# Altium project NA61_BPD_FEE.PrjPcb (part 1 of 4)
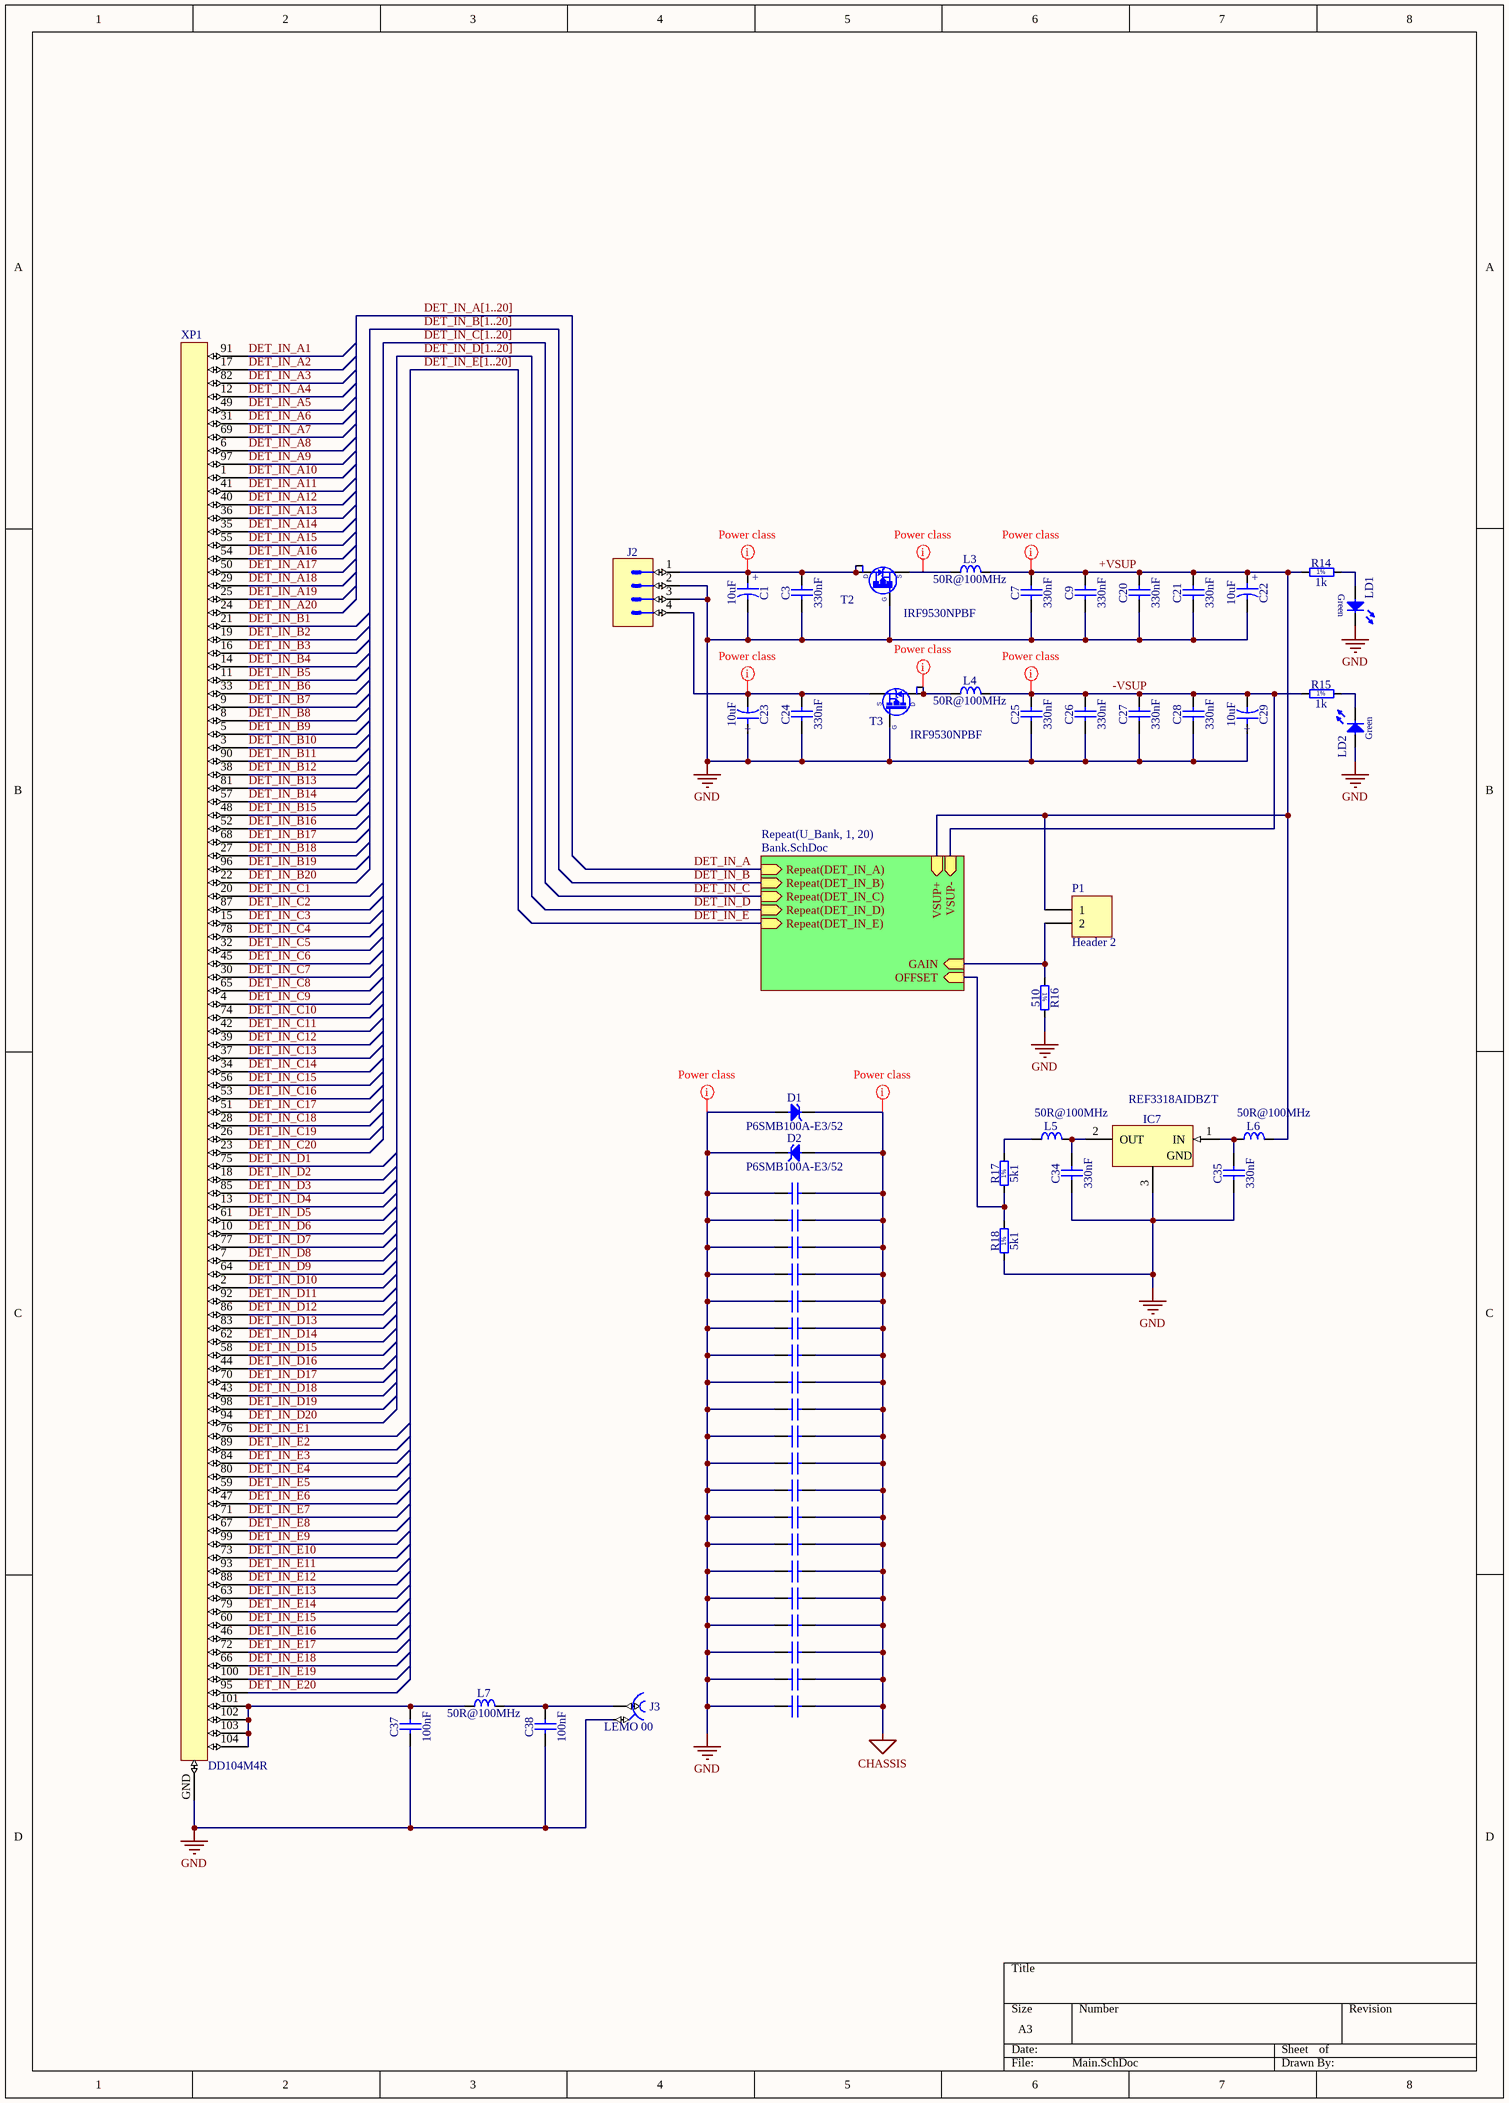
[diagram p0: Main.SchDoc]
3 sheets, 3559 parts. Net scope: hierarchical (ports join the sheet entries above them; power ports are global).
Board file: FEE_PCB.PcbDoc
Sheets:
  Main.SchDoc
    U_Bank1 = Bank.SchDoc
      U_Amp = Amp.SchDoc
      U_Amp = Amp.SchDoc
      U_Amp = Amp.SchDoc
      U_Amp = Amp.SchDoc
      U_Amp = Amp.SchDoc
    U_Bank2 = Bank.SchDoc
      U_Amp = Amp.SchDoc
      U_Amp = Amp.SchDoc
      U_Amp = Amp.SchDoc
      U_Amp = Amp.SchDoc
      U_Amp = Amp.SchDoc
    U_Bank3 = Bank.SchDoc
      U_Amp = Amp.SchDoc
      U_Amp = Amp.SchDoc
      U_Amp = Amp.SchDoc
      U_Amp = Amp.SchDoc
      U_Amp = Amp.SchDoc
    U_Bank4 = Bank.SchDoc
      U_Amp = Amp.SchDoc
      U_Amp = Amp.SchDoc
      U_Amp = Amp.SchDoc
      U_Amp = Amp.SchDoc
      U_Amp = Amp.SchDoc
    U_Bank5 = Bank.SchDoc
      U_Amp = Amp.SchDoc
      U_Amp = Amp.SchDoc
      U_Amp = Amp.SchDoc
      U_Amp = Amp.SchDoc
      U_Amp = Amp.SchDoc
    U_Bank6 = Bank.SchDoc
      U_Amp = Amp.SchDoc
      U_Amp = Amp.SchDoc
      U_Amp = Amp.SchDoc
      U_Amp = Amp.SchDoc
      U_Amp = Amp.SchDoc
    U_Bank7 = Bank.SchDoc
      U_Amp = Amp.SchDoc
      U_Amp = Amp.SchDoc
      U_Amp = Amp.SchDoc
      U_Amp = Amp.SchDoc
      U_Amp = Amp.SchDoc
    U_Bank8 = Bank.SchDoc
      U_Amp = Amp.SchDoc
      U_Amp = Amp.SchDoc
      U_Amp = Amp.SchDoc
      U_Amp = Amp.SchDoc
      U_Amp = Amp.SchDoc
    U_Bank9 = Bank.SchDoc
      U_Amp = Amp.SchDoc
      U_Amp = Amp.SchDoc
      U_Amp = Amp.SchDoc
      U_Amp = Amp.SchDoc
      U_Amp = Amp.SchDoc
    U_Bank10 = Bank.SchDoc
      U_Amp = Amp.SchDoc
      U_Amp = Amp.SchDoc
      U_Amp = Amp.SchDoc
      U_Amp = Amp.SchDoc
      U_Amp = Amp.SchDoc
    U_Bank11 = Bank.SchDoc
      U_Amp = Amp.SchDoc
      U_Amp = Amp.SchDoc
      U_Amp = Amp.SchDoc
      U_Amp = Amp.SchDoc
      U_Amp = Amp.SchDoc
    U_Bank12 = Bank.SchDoc
      U_Amp = Amp.SchDoc
      U_Amp = Amp.SchDoc
      U_Amp = Amp.SchDoc
      U_Amp = Amp.SchDoc
      U_Amp = Amp.SchDoc
    U_Bank13 = Bank.SchDoc
      U_Amp = Amp.SchDoc
      U_Amp = Amp.SchDoc
      U_Amp = Amp.SchDoc
      U_Amp = Amp.SchDoc
      U_Amp = Amp.SchDoc
    U_Bank14 = Bank.SchDoc
      U_Amp = Amp.SchDoc
      U_Amp = Amp.SchDoc
      U_Amp = Amp.SchDoc
      U_Amp = Amp.SchDoc
      U_Amp = Amp.SchDoc
    U_Bank15 = Bank.SchDoc
      U_Amp = Amp.SchDoc
      U_Amp = Amp.SchDoc
      U_Amp = Amp.SchDoc
      U_Amp = Amp.SchDoc
      U_Amp = Amp.SchDoc
    U_Bank16 = Bank.SchDoc
      U_Amp = Amp.SchDoc
      U_Amp = Amp.SchDoc
      U_Amp = Amp.SchDoc
      U_Amp = Amp.SchDoc
      U_Amp = Amp.SchDoc
    U_Bank17 = Bank.SchDoc
      U_Amp = Amp.SchDoc
      U_Amp = Amp.SchDoc
      U_Amp = Amp.SchDoc
      U_Amp = Amp.SchDoc
      U_Amp = Amp.SchDoc
    U_Bank18 = Bank.SchDoc
      U_Amp = Amp.SchDoc
      U_Amp = Amp.SchDoc
      U_Amp = Amp.SchDoc
      U_Amp = Amp.SchDoc
      U_Amp = Amp.SchDoc
    U_Bank19 = Bank.SchDoc
      U_Amp = Amp.SchDoc
      U_Amp = Amp.SchDoc
      U_Amp = Amp.SchDoc
      U_Amp = Amp.SchDoc
      U_Amp = Amp.SchDoc
    U_Bank20 = Bank.SchDoc
      U_Amp = Amp.SchDoc
      U_Amp = Amp.SchDoc
      U_Amp = Amp.SchDoc
      U_Amp = Amp.SchDoc
      U_Amp = Amp.SchDoc

## Sheet Main.SchDoc
size A3 portrait

### Parts
C1  10uF  [CAPAE430X540N]
C3  330nF  [CAPC2012X145N]
C7  330nF  [CAPC2012X145N]
C9  330nF  [CAPC2012X145N]
C20  330nF  [CAPC2012X145N]
C21  330nF  [CAPC2012X145N]
C22  10uF  [CAPAE430X540N]
C23  10uF  [CAPAE430X540N]
C24  330nF  [CAPC2012X145N]
C25  330nF  [CAPC2012X145N]
C26  330nF  [CAPC2012X145N]
C27  330nF  [CAPC2012X145N]
C28  330nF  [CAPC2012X145N]
C29  10uF  [CAPAE430X540N]
C31  100nF  [CAPC3216X140N]  (value not drawn)
C32  100nF  [CAPC3216X140N]  (value not drawn)
C33  100nF  [CAPC3216X140N]  (value not drawn)
C34  330nF  [CAPC2012X145N]
C35  330nF  [CAPC2012X145N]
C36  100nF  [CAPC3216X140N]  (value not drawn)
C37  100nF  [CAPC3216X140N]
C38  100nF  [CAPC3216X140N]
C39  100nF  [CAPC3216X140N]  (value not drawn)
C40  100nF  [CAPC3216X140N]  (value not drawn)
C41  100nF  [CAPC3216X140N]  (value not drawn)
C42  100nF  [CAPC3216X140N]  (value not drawn)
C43  100nF  [CAPC3216X140N]  (value not drawn)
C44  100nF  [CAPC3216X140N]  (value not drawn)
C45  100nF  [CAPC3216X140N]  (value not drawn)
C46  100nF  [CAPC3216X140N]  (value not drawn)
C47  100nF  [CAPC3216X140N]  (value not drawn)
C48  100nF  [CAPC3216X140N]  (value not drawn)
C49  100nF  [CAPC3216X140N]  (value not drawn)
C50  100nF  [CAPC3216X140N]  (value not drawn)
C51  100nF  [CAPC3216X140N]  (value not drawn)
C52  100nF  [CAPC3216X140N]  (value not drawn)
C53  100nF  [CAPC3216X140N]  (value not drawn)
C54  100nF  [CAPC3216X140N]  (value not drawn)
D1  P6SMB100A-E3/52  [DIOM5436X244N]
D2  P6SMB100A-E3/52  [DIOM5436X244N]
IC7  REF3318AIDBZT  [SOT95P237X112-3N]
J2  Header 4  [WURTH_691 313 410 004]  (value not drawn)
J3  LEMO 00  [LEMO_EPK.00.250.NTN]
L3  50R@100MHz  [IND_MURATA_BLM31PG]
L4  50R@100MHz  [IND_MURATA_BLM31PG]
L5  50R@100MHz  [IND_MURATA_BLM31PG]
L6  50R@100MHz  [IND_MURATA_BLM31PG]
L7  50R@100MHz  [IND_MURATA_BLM31PG]
LD1  Green  [LED_OSRAM_LGR971]  (value not drawn)
LD2  Green  [LED_OSRAM_LGR971]  (value not drawn)
P1  Header 2  [HDR1X2]
R14  1k  [RESC2012X60N]
R15  1k  [RESC2012X60N]
R16  510  [RESC2012X60N]
R17  5k1  [RESC2012X60N]
R18  5k1  [RESC2012X60N]
T2  IRF9530NPBF  [TO-220-H]
T3  IRF9530NPBF  [TO-220-H]
XP1  DD104M4R  [DB104]

### Sub-sheets
Repeat(U_Bank, 1, 20) = Bank.SchDoc: VSUP+ (in), VSUP- (in), GAIN (in), OFFSET (in), Repeat(DET_IN_E) (in), Repeat(DET_IN_D) (in), Repeat(DET_IN_C) (in), Repeat(DET_IN_B) (in), Repeat(DET_IN_A) (in)

### Nets
CHASSIS: C31.2 C32.2 C33.2 C36.2 C39.2 C40.2 C41.2 C42.2 C43.2 C44.2 C45.2 C46.2 C47.2 C48.2 C49.2 C50.2 C51.2 C52.2 C53.2 C54.2 D1.1(C) D2.2(A)
GND: C1.2 C3.1 C7.1 C9.1 C20.1 C21.1 C22.2 C23.1 C24.1 C25.1 C26.1 C27.1 C28.1 C29.1 C31.1 C32.1 C33.1 C34.1 C35.1 C36.1 C37.1 C38.1 C39.1 C40.1 C41.1 C42.1 C43.1 C44.1 C45.1 C46.1 C47.1 C48.1 C49.1 C50.1 C51.1 C52.1 C53.1 C54.1 D1.2(A) D2.1(C) IC7.3(GND) J2.2 J2.3 J3.2 LD1.1(C) LD2.2(A) R16.2 R18.1 T2.1(G) T3.1(G) XP1.GND
+VSUP: C7.2 C9.2 C20.2 C21.2 C22.1 L3.2 L6.2 P1.1 R14.1 ; sheet Repeat(U_Bank, 1, 20)/VSUP+
-VSUP: C25.2 C26.2 C27.2 C28.2 C29.2 L4.2 R15.1 ; sheet Repeat(U_Bank, 1, 20)/VSUP-
DET_IN_A: sheet Repeat(U_Bank, 1, 20)/Repeat(DET_IN_A)
DET_IN_A1: XP1.91  [project net DET_IN_A]
DET_IN_A2: XP1.17  [project net DET_IN_A]
DET_IN_A3: XP1.82  [project net DET_IN_A]
DET_IN_A4: XP1.12  [project net DET_IN_A]
DET_IN_A5: XP1.49  [project net DET_IN_A]
DET_IN_A6: XP1.31  [project net DET_IN_A]
DET_IN_A7: XP1.69  [project net DET_IN_A]
DET_IN_A8: XP1.6  [project net DET_IN_A]
DET_IN_A9: XP1.97  [project net DET_IN_A]
DET_IN_A10: XP1.1  [project net DET_IN_A]
DET_IN_A11: XP1.41  [project net DET_IN_A]
DET_IN_A12: XP1.40  [project net DET_IN_A]
DET_IN_A13: XP1.36  [project net DET_IN_A]
DET_IN_A14: XP1.35  [project net DET_IN_A]
DET_IN_A15: XP1.55  [project net DET_IN_A]
DET_IN_A16: XP1.54  [project net DET_IN_A]
DET_IN_A17: XP1.50  [project net DET_IN_A]
DET_IN_A18: XP1.29  [project net DET_IN_A]
DET_IN_A19: XP1.25  [project net DET_IN_A]
DET_IN_A20: XP1.24  [project net DET_IN_A]
DET_IN_B: sheet Repeat(U_Bank, 1, 20)/Repeat(DET_IN_B)
DET_IN_B1: XP1.21  [project net DET_IN_B]
DET_IN_B2: XP1.19  [project net DET_IN_B]
DET_IN_B3: XP1.16  [project net DET_IN_B]
DET_IN_B4: XP1.14  [project net DET_IN_B]
DET_IN_B5: XP1.11  [project net DET_IN_B]
DET_IN_B6: XP1.33  [project net DET_IN_B]
DET_IN_B7: XP1.9  [project net DET_IN_B]
DET_IN_B8: XP1.8  [project net DET_IN_B]
DET_IN_B9: XP1.5  [project net DET_IN_B]
DET_IN_B10: XP1.3  [project net DET_IN_B]
DET_IN_B11: XP1.90  [project net DET_IN_B]
DET_IN_B12: XP1.38  [project net DET_IN_B]
DET_IN_B13: XP1.81  [project net DET_IN_B]
DET_IN_B14: XP1.57  [project net DET_IN_B]
DET_IN_B15: XP1.48  [project net DET_IN_B]
DET_IN_B16: XP1.52  [project net DET_IN_B]
DET_IN_B17: XP1.68  [project net DET_IN_B]
DET_IN_B18: XP1.27  [project net DET_IN_B]
DET_IN_B19: XP1.96  [project net DET_IN_B]
DET_IN_B20: XP1.22  [project net DET_IN_B]
DET_IN_C: sheet Repeat(U_Bank, 1, 20)/Repeat(DET_IN_C)
DET_IN_C1: XP1.20  [project net DET_IN_C]
DET_IN_C2: XP1.87  [project net DET_IN_C]
DET_IN_C3: XP1.15  [project net DET_IN_C]
DET_IN_C4: XP1.78  [project net DET_IN_C]
DET_IN_C5: XP1.32  [project net DET_IN_C]
DET_IN_C6: XP1.45  [project net DET_IN_C]
DET_IN_C7: XP1.30  [project net DET_IN_C]
DET_IN_C8: XP1.65  [project net DET_IN_C]
DET_IN_C9: XP1.4  [project net DET_IN_C]
DET_IN_C10: XP1.74  [project net DET_IN_C]
DET_IN_C11: XP1.42  [project net DET_IN_C]
DET_IN_C12: XP1.39  [project net DET_IN_C]
DET_IN_C13: XP1.37  [project net DET_IN_C]
DET_IN_C14: XP1.34  [project net DET_IN_C]
DET_IN_C15: XP1.56  [project net DET_IN_C]
DET_IN_C16: XP1.53  [project net DET_IN_C]
DET_IN_C17: XP1.51  [project net DET_IN_C]
DET_IN_C18: XP1.28  [project net DET_IN_C]
DET_IN_C19: XP1.26  [project net DET_IN_C]
DET_IN_C20: XP1.23  [project net DET_IN_C]
DET_IN_D: sheet Repeat(U_Bank, 1, 20)/Repeat(DET_IN_D)
DET_IN_D1: XP1.75  [project net DET_IN_D]
DET_IN_D2: XP1.18  [project net DET_IN_D]
DET_IN_D3: XP1.85  [project net DET_IN_D]
DET_IN_D4: XP1.13  [project net DET_IN_D]
DET_IN_D5: XP1.61  [project net DET_IN_D]
DET_IN_D6: XP1.10  [project net DET_IN_D]
DET_IN_D7: XP1.77  [project net DET_IN_D]
DET_IN_D8: XP1.7  [project net DET_IN_D]
DET_IN_D9: XP1.64  [project net DET_IN_D]
DET_IN_D10: XP1.2  [project net DET_IN_D]
DET_IN_D11: XP1.92  [project net DET_IN_D]
DET_IN_D12: XP1.86  [project net DET_IN_D]
DET_IN_D13: XP1.83  [project net DET_IN_D]
DET_IN_D14: XP1.62  [project net DET_IN_D]
DET_IN_D15: XP1.58  [project net DET_IN_D]
DET_IN_D16: XP1.44  [project net DET_IN_D]
DET_IN_D17: XP1.70  [project net DET_IN_D]
DET_IN_D18: XP1.43  [project net DET_IN_D]
DET_IN_D19: XP1.98  [project net DET_IN_D]
DET_IN_D20: XP1.94  [project net DET_IN_D]
DET_IN_E: sheet Repeat(U_Bank, 1, 20)/Repeat(DET_IN_E)
DET_IN_E1: XP1.76  [project net DET_IN_E]
DET_IN_E2: XP1.89  [project net DET_IN_E]
DET_IN_E3: XP1.84  [project net DET_IN_E]
DET_IN_E4: XP1.80  [project net DET_IN_E]
DET_IN_E5: XP1.59  [project net DET_IN_E]
DET_IN_E6: XP1.47  [project net DET_IN_E]
DET_IN_E7: XP1.71  [project net DET_IN_E]
DET_IN_E8: XP1.67  [project net DET_IN_E]
DET_IN_E9: XP1.99  [project net DET_IN_E]
DET_IN_E10: XP1.73  [project net DET_IN_E]
DET_IN_E11: XP1.93  [project net DET_IN_E]
DET_IN_E12: XP1.88  [project net DET_IN_E]
DET_IN_E13: XP1.63  [project net DET_IN_E]
DET_IN_E14: XP1.79  [project net DET_IN_E]
DET_IN_E15: XP1.60  [project net DET_IN_E]
DET_IN_E16: XP1.46  [project net DET_IN_E]
DET_IN_E17: XP1.72  [project net DET_IN_E]
DET_IN_E18: XP1.66  [project net DET_IN_E]
DET_IN_E19: XP1.100  [project net DET_IN_E]
DET_IN_E20: XP1.95  [project net DET_IN_E]
NetC1_1: C1.1 C3.2 J2.1 T2.2(D) T2.4(D)
NetC23_2: C23.2 C24.2 J2.4 T3.3(S)
NetC34_2: C34.2 IC7.2(OUT) L5.2
NetC35_2: C35.2 IC7.1(IN) L6.1
NetC37_2: C37.2 L7.1 XP1.101 XP1.102 XP1.103 XP1.104
NetC38_2: C38.2 J3.1 L7.2
NetL3_1: L3.1 T2.3(S)
NetL4_1: L4.1 T3.2(D) T3.4(D)
NetL5_1: L5.1 R17.2
NetLD1_2: LD1.2(A) R14.2
NetLD2_1: LD2.1(C) R15.2
NetP1_2: P1.2 R16.1 ; sheet Repeat(U_Bank, 1, 20)/GAIN
NetR12_U_Bank1_1: R17.1 R18.2 ; sheet Repeat(U_Bank, 1, 20)/OFFSET

### Buses and harness runs
bus DET_IN_A[1..20]
bus DET_IN_B[1..20]
bus DET_IN_C[1..20]
bus DET_IN_D[1..20]
bus DET_IN_E[1..20]

### Layout directives
net class Power: +VSUP, -VSUP, CHASSIS, GND, NetC1_1, NetC23_2, NetL3_1, NetL4_1

### Notes on the sheet
- (in symbol CAE430-540_10UF_16V_20%) +
- (in symbol R0805_1K_1%_0.125W_100PPM) 1%
- (in symbol R0805_5K1_1%_0.125W_100PPM) 1%
- (in symbol R0805_510R_1%_0.125W_100PPM) 1%

### Library data of the parts
C1 C22 C23 C29 = CAE430-540_10UF_16V_20%: Polarised capacitor; Part Description: Aluminum Electrolytic SMT Capacitor; Manufacturer: PANASONIC; Manufacturer Part Number: EEEFK1C100AR; Voltage: 16V; Tolerance: ±20%; Part Number: CAE430-540_10UF_16V_20%; Component Kind: Standard; Component Type: Standard; Pin Count: 2; Value: 10uF; Status: Not Recommended; Case: B; Mounted: Yes; Socket: No; SMD: Yes; Sense: No; ComponentHeight: 5.8mm; HelpURL: \\cern.ch\dfs\Applications\Altium\Datasheets\CAE_PANASONIC_FK.pdf; Author: CERN DEM JLC; CreateDate: 03.12.2007; LatestRevisionDate: 05.11.2014
C3 C7 C9 C20 C21 C24-C28 C34 C35 = CC0805_330NF_50V_20%_X5R: Non-polarised capacitor; Part Description: SMD Multilayer Chip Ceramic Capacitor; Manufacturer: GENERIC; Manufacturer1 Part Number: C2012X5R1H334M125AA; Voltage: 50V; TC: X5R; Tolerance: ±20%; Part Number: CC0805_330NF_50V_20%_X5R; Component Kind: Standard; Component Type: Standard; Pin Count: 2; Value: 330nF; Status: Preferred; Manufacturer Part Number: CC0805_330NF_50V_20%_X5R; Case: 0805; Mounted: Yes; Socket: No; SMD: Yes; Sense: No; Manufacturer1 Example: TDK; Manufacturer1 ComponentHeight: 1.45mm; HelpURL: \\cern.ch\dfs\Applications\Altium\Datasheets\CC0805_X5R_TDK_C.pdf; Author: CERN DEM MR; CreateDate: 16.09.2016; LatestRevisionDate: 16.09.2016
C31-C33 C36-C54 = CC1206_100NF_200V_10%_X7R: Non-polarised capacitor; Part Description: SMD Ceramic Chip Capacitor; Manufacturer: GENERIC; Manufacturer1 Part Number: C1206C104K2RAC; Voltage: 200V; TC: X7R; Tolerance: ±10%; Part Number: CC1206_100NF_200V_10%_X7R; Component Kind: Standard; Component Type: Standard; Pin Count: 2; Value: 100nF; Status: None; Manufacturer Part Number: CC1206_100NF_200V_10%_X7R; Case: 1206; Mounted: Yes; Socket: No; SMD: Yes; Sense: No; Manufacturer1 Example: KEMET; Manufacturer1 ComponentHeight: 1.4mm; HelpURL: \\cern.ch\dfs\Applications\Altium\Datasheets\CC1206_X7R_KEMET.pdf; Author: CERN DEM JLC; CreateDate: 16.09.2009; LatestRevisionDate: 16.09.2009
D1 D2 = P6SMB100A-E3/52: Transient Voltage Suppressor Diode (Uni-Directional); Part Description: Surface Mount Uni-directional TRANSZORB® Transient Voltage Suppressor; Manufacturer: VISHAY GENERAL SEMICONDUCTOR; Voltage: 100V; Power: 600W; PressFit: No; Bonding: No; Part Number: P6SMB100A-E3/52; Component Kind: Standard; Component Type: Standard; Device: P6SMB100A-E3/52; PackageDescription: DO-214-AA/SMB Diode, Molded Body; 5.40mm L X 3.62mm W X 2.44mm H, IPC Medium Density; Manufacturer Part Number: P6SMB100A-E3/52; Pin Count: 2; Case: SMB; Mounted: Yes; Socket: No; SMD: Yes; Sense: No; ComponentHeight: 2.44mm; HelpURL: \\cern.ch\dfs\Applications\Altium\Datasheets\P6SMB100A-E3-52.pdf; Author: CERN DEM JLC; CreateDate: 15.11.2016; LatestRevisionDate: 12.07.2017
IC7 = REF3318AIDBZT: 3-Terminal Regulator 1=IN 2=OUT 3=GND; Part Description: 1.8V, 30ppm/°C Drift, 3.9uA, Voltage Reference; Manufacturer: TEXAS INSTRUMENTS; PressFit: No; Bonding: No; Part Number: REF3318AIDBZT; Component Kind: Standard; Component Type: Standard; Device: REF3318AIDBZT; PackageDescription: SOT, 0.95mm, pitch; 3 pin,1.30mm W X 2.92mm L X 1.12mm H body, IPC Medium Density; Manufacturer Part Number: REF3318AIDBZT; Pin Count: 3; Case: SOT23; Mounted: Yes; Socket: No; SMD: Yes; Sense: No; ComponentHeight: 1.12mm; HelpURL: \\cern.ch\dfs\Applications\Altium\Datasheets\REF3318AIDBZT.pdf; Author: CERN DEM JLC; CreateDate: 20.06.2011; LatestRevisionDate: 20.06.2011
J2 = WURTH_691 313 410 004: Connector 4 Male; Part Description: 4 Contacts, Single Row, Right Angled Serie 3134-7.62mm; Manufacturer: WURTH ELEKTRONIK; PressFit: No; Part Number: WURTH_691 313 410 004; Component Kind: Standard; Component Type: Standard; Pin Count: 4; Family: Header 4; Mounted: Yes; Socket: No; SMD: No; Sense: No; Status: None; Manufacturer Part Number: 691 313 410 004; ComponentHeight: 8.5mm; HelpURL: \\cern.ch\dfs\Applications\Altium\Datasheets\WURTH_691 313 410 004.pdf; Author: CERN DEM MR; CreateDate: 08.04.2016; LatestRevisionDate: 08.04.2016
J3 = LEMO_EPK.00.250.NTN: Part Description: Size 00, 50 Ohms Coaxial Elbow (90°) socket With Clearance Under The Body; PressFit: No; SCEM: 09.46.11.180.6; Part Number: LEMO_EPK.00.250.NTN; Component Kind: Standard; Component Type: Standard; Pin Count: 2; Family: LEMO 00; Mounted: Yes; Socket: No; SMD: No; Sense: No; Status: None; Manufacturer: LEMO; Manufacturer Part Number: EPK.00.250.NTN; ComponentHeight: 7mm; HelpURL: \\cern.ch\dfs\Applications\Altium\Datasheets\LEMO_EPK.00.250.NTN.pdf; Author: CERN DEM JLC; CreateDate: 04.09.2012; LatestRevisionDate: 04.09.2012
L3-L7 = IND1206_MURATA_BLM31PG500SN1: Inductor; Part Description: SMD EMIFIL Chip Ferrite Bead; Manufacturer: MURATA; Power: 3.5A; Resistance: 0.015R; Part Number: IND1206_MURATA_BLM31PG500SN1; Component Kind: Standard; Component Type: Standard; Pin Count: 2; Value: 50R@100MHz; Status: None; Manufacturer Part Number: BLM31PG500SN1; Case: 1206; Mounted: Yes; Socket: No; SMD: Yes; Sense: No; ComponentHeight: 1.3mm; HelpURL: \\cern.ch\dfs\Applications\Altium\Datasheets\IND1206_MURATA_BLM31P.pdf; Author: CERN DEM JLC; CreateDate: 05.12.2013; LatestRevisionDate: 05.12.2013
LD1 LD2 = LED_OSRAM_LGR971: LED Green 1C 2A; Part Description: Surface Mount Green LED (0805 Case); Manufacturer: OSRAM; Manufacturer Part Number: LGR971; PressFit: No; Bonding: No; Part Number: LED_OSRAM_LGR971; Component Kind: Standard; Component Type: Standard; Color: Green; PackageDescription: Green Chip LED, 2-Leads, Body 2.0x1.25mm, IPC Medium Density; Pin Count: 2; Case: 0805; Mounted: Yes; Socket: No; SMD: Yes; Sense: No; ComponentHeight: 0.9mm; HelpURL: \\cern.ch\dfs\Applications\Altium\Datasheets\LED_OSRAM_LGR971.pdf; Author: CERN DEM JLC; CreateDate: 28.01.2009; LatestRevisionDate: 17.03.2010
P1 = Header 2: Header, 2-Pin; LatestRevisionDate: 17-Jul-2002; LatestRevisionNote: Re-released for DXP Platform.; Publisher: Altium Limited
R14 R15 = R0805_1K_1%_0.125W_100PPM: Resistor - 1%; Part Description: General Purpose Thick Film Chip Resistor; Manufacturer: GENERIC; Manufacturer1 Part Number: NRC10F1001TRF; Power: 0.125W; TC: ±100ppm/°C; PressFit: No; Part Number: R0805_1K_1%_0.125W_100PPM; Component Kind: Standard; Component Type: Standard; Pin Count: 2; Value: 1k; Status: Preferred; Tolerance: ±1%; Manufacturer Part Number: R0805_1K_1%_0.125W_100PPM; Case: 0805; Mounted: Yes; Sense: No; Socket: No; SMD: Yes; Manufacturer1 Example: NIC COMPONENT; Manufacturer1 ComponentHeight: 0.6mm; HelpURL: \\cern.ch\dfs\Applications\Altium\Datasheets\R0805_NIC_NRC.pdf; Author: CERN DEM JLC; CreateDate: 03.12.2007; LatestRevisionDate: 13.03.2008
R16 = R0805_510R_1%_0.125W_100PPM: Resistor - 1%; Part Description: General Purpose Thick Film Chip Resistor; Manufacturer: GENERIC; Manufacturer1 Part Number: NRC10F5100TRF; Power: 0.125W; TC: ±100ppm/°C; PressFit: No; Part Number: R0805_510R_1%_0.125W_100PPM; Component Kind: Standard; Component Type: Standard; Pin Count: 2; Value: 510; Status: Preferred; Tolerance: ±1%; Manufacturer Part Number: R0805_510R_1%_0.125W_100PPM; Case: 0805; Mounted: Yes; Sense: No; Socket: No; SMD: Yes; Manufacturer1 Example: NIC COMPONENT; Manufacturer1 ComponentHeight: 0.6mm; HelpURL: \\cern.ch\dfs\Applications\Altium\Datasheets\R0805_NIC_NRC.pdf; Author: CERN DEM JLC; CreateDate: 03.12.2007; LatestRevisionDate: 13.03.2008
R17 R18 = R0805_5K1_1%_0.125W_100PPM: Resistor - 1%; Part Description: General Purpose Thick Film Chip Resistor; Manufacturer: GENERIC; Manufacturer1 Part Number: NRC10F5101TRF; Power: 0.125W; TC: ±100ppm/°C; PressFit: No; Part Number: R0805_5K1_1%_0.125W_100PPM; Component Kind: Standard; Component Type: Standard; Pin Count: 2; Value: 5k1; Status: Preferred; Tolerance: ±1%; Manufacturer Part Number: R0805_5K1_1%_0.125W_100PPM; Case: 0805; Mounted: Yes; Sense: No; Socket: No; SMD: Yes; Manufacturer1 Example: NIC COMPONENT; Manufacturer1 ComponentHeight: 0.6mm; HelpURL: \\cern.ch\dfs\Applications\Altium\Datasheets\R0805_NIC_NRC.pdf; Author: CERN DEM JLC; CreateDate: 03.12.2007; LatestRevisionDate: 13.03.2008
T2 T3 = IRF9530NPBF_h: P-CHANNEL MOSFET WITH ZENER DIODE; Part Description: -100V -14A P-Channel HEXFET Power MOSFET; Manufacturer: INTERNATIONAL RECTIFIER; PressFit: No; Bonding: No; Part Number: IRF9530NPBF_h; Component Kind: Standard; Component Type: Standard; Device: IRF9530NPBF; PackageDescription: TO-220 3-Terminal + Tab - Horizontal; Manufacturer Part Number: IRF9530NPBF; Pin Count: 4; Case: TO-220; Mounted: Yes; Socket: No; SMD: No; Sense: No; ComponentHeight: 4.69mm; HelpURL: \\cern.ch\dfs\Applications\Altium\Datasheets\IRF9530NPBF.pdf; Author: CERN DEM MR; CreateDate: 21.10.2016; LatestRevisionDate: 21.10.2016

## Sheet Bank.SchDoc
size A4
Used 20 times, as channels U_Bank1, U_Bank2, U_Bank3, U_Bank4, U_Bank5, U_Bank6, U_Bank7, U_Bank8, U_Bank9, U_Bank10, U_Bank11, U_Bank12, U_Bank13, U_Bank14, U_Bank15, U_Bank16, U_Bank17, U_Bank18, U_Bank19, U_Bank20. Parts and nets are listed once, with the designators drawn on the sheet.
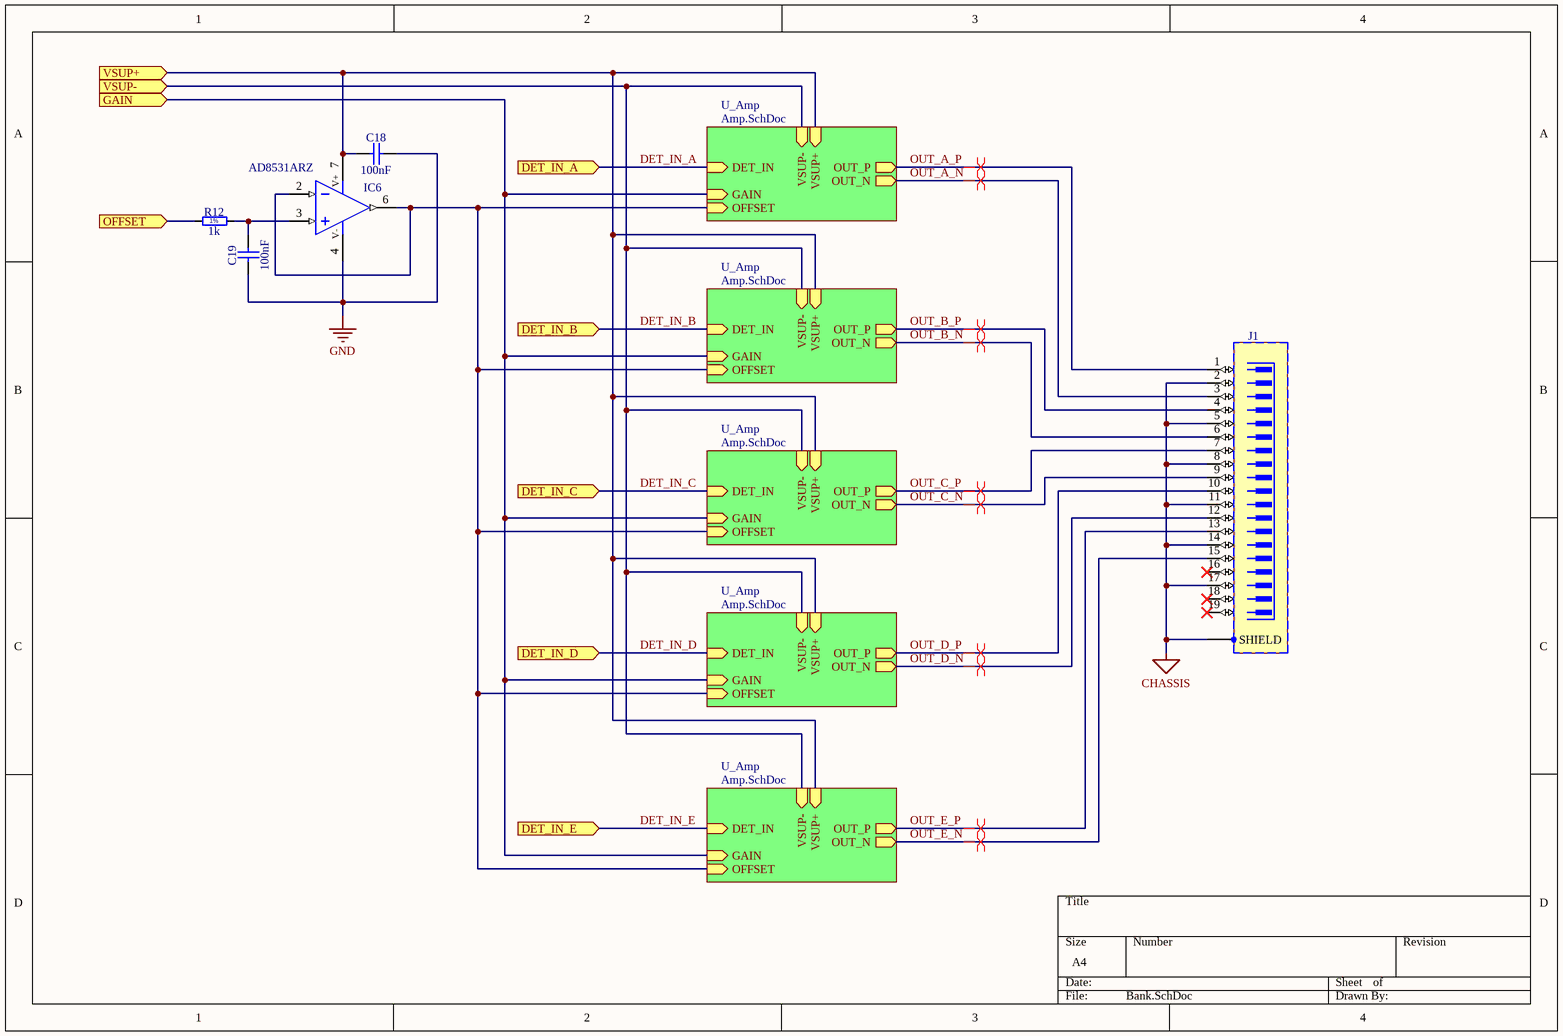
[diagram p1: Bank.SchDoc]

### Parts
C18  100nF  [CAPC2012X135N]
C19  100nF  [CAPC2012X135N]
IC6  AD8531ARZ  [SOIC127P600X175-8N]
J1  HDMI  [TYCO_2007435-1]  (value not drawn)
R12  1k  [RESC2012X60N]

### Sub-sheets
U_Amp = Amp.SchDoc: VSUP+ (in), VSUP- (in), DET_IN (in), OFFSET (in), OUT_P (out), OUT_N (out), GAIN (in)
U_Amp = Amp.SchDoc: VSUP+ (in), VSUP- (in), DET_IN (in), OFFSET (in), OUT_P (out), OUT_N (out), GAIN (in)
U_Amp = Amp.SchDoc: VSUP+ (in), VSUP- (in), DET_IN (in), OFFSET (in), OUT_P (out), OUT_N (out), GAIN (in)
U_Amp = Amp.SchDoc: VSUP+ (in), VSUP- (in), DET_IN (in), OFFSET (in), OUT_P (out), OUT_N (out), GAIN (in)
U_Amp = Amp.SchDoc: VSUP+ (in), VSUP- (in), DET_IN (in), OFFSET (in), OUT_P (out), OUT_N (out), GAIN (in)

### Ports
DET_IN_A (in), DET_IN_B (in), DET_IN_C (in), DET_IN_D (in), DET_IN_E (in), GAIN (in), OFFSET (in), VSUP+ (in), VSUP- (in)

### Nets
CHASSIS: J1.2 J1.5 J1.8 J1.11 J1.14 J1.17 J1.SHIELD
GND: C18.2 C19.1 IC6.4(V-)
DET_IN_A: port DET_IN_A, sheet U_Amp/DET_IN
DET_IN_B: port DET_IN_B, sheet U_Amp/DET_IN
DET_IN_C: port DET_IN_C, sheet U_Amp/DET_IN
DET_IN_D: port DET_IN_D, sheet U_Amp/DET_IN
DET_IN_E: port DET_IN_E, sheet U_Amp/DET_IN
GAIN: port GAIN, sheet U_Amp/GAIN, sheet U_Amp/GAIN, sheet U_Amp/GAIN, sheet U_Amp/GAIN, sheet U_Amp/GAIN
OFFSET: R12.1 ; port OFFSET
OUT_A_N: J1.3 ; sheet U_Amp/OUT_N
OUT_A_P: J1.1 ; sheet U_Amp/OUT_P
OUT_B_N: J1.6 ; sheet U_Amp/OUT_N
OUT_B_P: J1.4 ; sheet U_Amp/OUT_P
OUT_C_N: J1.9 ; sheet U_Amp/OUT_N
OUT_C_P: J1.7 ; sheet U_Amp/OUT_P
OUT_D_N: J1.12 ; sheet U_Amp/OUT_N
OUT_D_P: J1.10 ; sheet U_Amp/OUT_P
OUT_E_N: J1.15 ; sheet U_Amp/OUT_N
OUT_E_P: J1.13 ; sheet U_Amp/OUT_P
VSUP+: C18.1 IC6.7(V+) ; port VSUP+, sheet U_Amp/VSUP+, sheet U_Amp/VSUP+, sheet U_Amp/VSUP+, sheet U_Amp/VSUP+, sheet U_Amp/VSUP+
VSUP-: port VSUP-, sheet U_Amp/VSUP-, sheet U_Amp/VSUP-, sheet U_Amp/VSUP-, sheet U_Amp/VSUP-, sheet U_Amp/VSUP-
NetC19_2: C19.2 IC6.3(IN+) R12.2
NetIC6_2: IC6.2(IN-) IC6.6(OUT) ; sheet U_Amp/OFFSET, sheet U_Amp/OFFSET, sheet U_Amp/OFFSET, sheet U_Amp/OFFSET, sheet U_Amp/OFFSET

Not connected (* = marked no-connect by the designer): J1 16* 18* 19*

### Channels
U_Bank1: designators end in _U_Bank1; ports DET_IN_A=DET_IN_A DET_IN_B=DET_IN_B DET_IN_C=DET_IN_C DET_IN_D=DET_IN_D DET_IN_E=DET_IN_E GAIN=NetP1_2 OFFSET=NetR12_U_Bank1_1 VSUP+=+VSUP VSUP-=-VSUP
U_Bank2: designators end in _U_Bank2; ports DET_IN_A=DET_IN_A DET_IN_B=DET_IN_B DET_IN_C=DET_IN_C DET_IN_D=DET_IN_D DET_IN_E=DET_IN_E GAIN=NetP1_2 OFFSET=NetR12_U_Bank1_1 VSUP+=+VSUP VSUP-=-VSUP
U_Bank3: designators end in _U_Bank3; ports DET_IN_A=DET_IN_A DET_IN_B=DET_IN_B DET_IN_C=DET_IN_C DET_IN_D=DET_IN_D DET_IN_E=DET_IN_E GAIN=NetP1_2 OFFSET=NetR12_U_Bank1_1 VSUP+=+VSUP VSUP-=-VSUP
U_Bank4: designators end in _U_Bank4; ports DET_IN_A=DET_IN_A DET_IN_B=DET_IN_B DET_IN_C=DET_IN_C DET_IN_D=DET_IN_D DET_IN_E=DET_IN_E GAIN=NetP1_2 OFFSET=NetR12_U_Bank1_1 VSUP+=+VSUP VSUP-=-VSUP
U_Bank5: designators end in _U_Bank5; ports DET_IN_A=DET_IN_A DET_IN_B=DET_IN_B DET_IN_C=DET_IN_C DET_IN_D=DET_IN_D DET_IN_E=DET_IN_E GAIN=NetP1_2 OFFSET=NetR12_U_Bank1_1 VSUP+=+VSUP VSUP-=-VSUP
U_Bank6: designators end in _U_Bank6; ports DET_IN_A=DET_IN_A DET_IN_B=DET_IN_B DET_IN_C=DET_IN_C DET_IN_D=DET_IN_D DET_IN_E=DET_IN_E GAIN=NetP1_2 OFFSET=NetR12_U_Bank1_1 VSUP+=+VSUP VSUP-=-VSUP
U_Bank7: designators end in _U_Bank7; ports DET_IN_A=DET_IN_A DET_IN_B=DET_IN_B DET_IN_C=DET_IN_C DET_IN_D=DET_IN_D DET_IN_E=DET_IN_E GAIN=NetP1_2 OFFSET=NetR12_U_Bank1_1 VSUP+=+VSUP VSUP-=-VSUP
U_Bank8: designators end in _U_Bank8; ports DET_IN_A=DET_IN_A DET_IN_B=DET_IN_B DET_IN_C=DET_IN_C DET_IN_D=DET_IN_D DET_IN_E=DET_IN_E GAIN=NetP1_2 OFFSET=NetR12_U_Bank1_1 VSUP+=+VSUP VSUP-=-VSUP
U_Bank9: designators end in _U_Bank9; ports DET_IN_A=DET_IN_A DET_IN_B=DET_IN_B DET_IN_C=DET_IN_C DET_IN_D=DET_IN_D DET_IN_E=DET_IN_E GAIN=NetP1_2 OFFSET=NetR12_U_Bank1_1 VSUP+=+VSUP VSUP-=-VSUP
U_Bank10: designators end in _U_Bank10; ports DET_IN_A=DET_IN_A DET_IN_B=DET_IN_B DET_IN_C=DET_IN_C DET_IN_D=DET_IN_D DET_IN_E=DET_IN_E GAIN=NetP1_2 OFFSET=NetR12_U_Bank1_1 VSUP+=+VSUP VSUP-=-VSUP
U_Bank11: designators end in _U_Bank11; ports DET_IN_A=DET_IN_A DET_IN_B=DET_IN_B DET_IN_C=DET_IN_C DET_IN_D=DET_IN_D DET_IN_E=DET_IN_E GAIN=NetP1_2 OFFSET=NetR12_U_Bank1_1 VSUP+=+VSUP VSUP-=-VSUP
U_Bank12: designators end in _U_Bank12; ports DET_IN_A=DET_IN_A DET_IN_B=DET_IN_B DET_IN_C=DET_IN_C DET_IN_D=DET_IN_D DET_IN_E=DET_IN_E GAIN=NetP1_2 OFFSET=NetR12_U_Bank1_1 VSUP+=+VSUP VSUP-=-VSUP
U_Bank13: designators end in _U_Bank13; ports DET_IN_A=DET_IN_A DET_IN_B=DET_IN_B DET_IN_C=DET_IN_C DET_IN_D=DET_IN_D DET_IN_E=DET_IN_E GAIN=NetP1_2 OFFSET=NetR12_U_Bank1_1 VSUP+=+VSUP VSUP-=-VSUP
U_Bank14: designators end in _U_Bank14; ports DET_IN_A=DET_IN_A DET_IN_B=DET_IN_B DET_IN_C=DET_IN_C DET_IN_D=DET_IN_D DET_IN_E=DET_IN_E GAIN=NetP1_2 OFFSET=NetR12_U_Bank1_1 VSUP+=+VSUP VSUP-=-VSUP
U_Bank15: designators end in _U_Bank15; ports DET_IN_A=DET_IN_A DET_IN_B=DET_IN_B DET_IN_C=DET_IN_C DET_IN_D=DET_IN_D DET_IN_E=DET_IN_E GAIN=NetP1_2 OFFSET=NetR12_U_Bank1_1 VSUP+=+VSUP VSUP-=-VSUP
U_Bank16: designators end in _U_Bank16; ports DET_IN_A=DET_IN_A DET_IN_B=DET_IN_B DET_IN_C=DET_IN_C DET_IN_D=DET_IN_D DET_IN_E=DET_IN_E GAIN=NetP1_2 OFFSET=NetR12_U_Bank1_1 VSUP+=+VSUP VSUP-=-VSUP
U_Bank17: designators end in _U_Bank17; ports DET_IN_A=DET_IN_A DET_IN_B=DET_IN_B DET_IN_C=DET_IN_C DET_IN_D=DET_IN_D DET_IN_E=DET_IN_E GAIN=NetP1_2 OFFSET=NetR12_U_Bank1_1 VSUP+=+VSUP VSUP-=-VSUP
U_Bank18: designators end in _U_Bank18; ports DET_IN_A=DET_IN_A DET_IN_B=DET_IN_B DET_IN_C=DET_IN_C DET_IN_D=DET_IN_D DET_IN_E=DET_IN_E GAIN=NetP1_2 OFFSET=NetR12_U_Bank1_1 VSUP+=+VSUP VSUP-=-VSUP
U_Bank19: designators end in _U_Bank19; ports DET_IN_A=DET_IN_A DET_IN_B=DET_IN_B DET_IN_C=DET_IN_C DET_IN_D=DET_IN_D DET_IN_E=DET_IN_E GAIN=NetP1_2 OFFSET=NetR12_U_Bank1_1 VSUP+=+VSUP VSUP-=-VSUP
U_Bank20: designators end in _U_Bank20; ports DET_IN_A=DET_IN_A DET_IN_B=DET_IN_B DET_IN_C=DET_IN_C DET_IN_D=DET_IN_D DET_IN_E=DET_IN_E GAIN=NetP1_2 OFFSET=NetR12_U_Bank1_1 VSUP+=+VSUP VSUP-=-VSUP

### Layout directives
differential pair: OUT_A_N_U_Bank1, OUT_A_P_U_Bank1, OUT_B_N_U_Bank1, OUT_B_P_U_Bank1, OUT_C_N_U_Bank1, OUT_C_P_U_Bank1, OUT_D_N_U_Bank1, OUT_D_P_U_Bank1, OUT_E_N_U_Bank1, OUT_E_P_U_Bank1

### Notes on the sheet
- (in symbol R0805_1K_1%_0.125W_100PPM) 1%

### Library data of the parts
C18 C19 = CC0805_100NF_50V_10%_X7R: Non-polarised capacitor; Part Description: SMD Multilayer Chip Ceramic Capacitor; Manufacturer: GENERIC; Manufacturer1 Part Number: C2012X7R1H104K085AA; Voltage: 50V; TC: X7R; Tolerance: ±10%; Part Number: CC0805_100NF_50V_10%_X7R; Component Kind: Standard; Component Type: Standard; Pin Count: 2; Value: 100nF; Status: Preferred; Manufacturer Part Number: CC0805_100NF_50V_10%_X7R; Case: 0805; Mounted: Yes; Socket: No; SMD: Yes; Sense: No; Manufacturer1 Example: TDK; Manufacturer1 ComponentHeight: 1mm; HelpURL: \\cern.ch\dfs\Applications\Altium\Datasheets\CC0805_X7R_TDK_C.pdf; Author: CERN DEM JLC; CreateDate: 03.12.2007; LatestRevisionDate: 22.04.2015
IC6 = AD8531ARZ: Operational Amplifier; Part Description: Low Cost, 250 mA Output, Single-Supply Amplifier; Manufacturer: ANALOG DEVICES; PressFit: No; Bonding: No; Part Number: AD8531ARZ; Component Kind: Standard; Component Type: Standard; Device: AD8531ARZ; PackageDescription: SOIC 8, Pitch 1.27mm - Body 4x5mm, IPC Medium Density; Manufacturer Part Number: AD8531ARZ; Pin Count: 8; Case: SOIC8; Mounted: Yes; Socket: No; SMD: Yes; Sense: No; ComponentHeight: 1.75mm; Author: CERN DEM JLC; HelpURL: \\cern.ch\dfs\Applications\Altium\Datasheets\AD8531ARZ.pdf; CreateDate: 12.06.2013; LatestRevisionDate: 12.06.2013
J1 = TYCO_2007435-1: Connector HDMI 19 Male + 1 Shield; Part Description: 0.578mm Pitch, Through-Hole Right Angle 19 Contacts Flag-HDMI Type-A Receptacle Thru Hole Mounting Pads; Manufacturer: TYCO ELECTRONICS; PressFit: No; Part Number: TYCO_2007435-1; Component Kind: Standard; Component Type: Standard; Pin Count: 23; Family: HDMI; Mounted: Yes; Socket: No; SMD: No; Sense: No; Status: None; Manufacturer Part Number: 2007435-1; ComponentHeight: 16.4mm; HelpURL: \\cern.ch\dfs\Applications\Altium\Datasheets\TYCO_2007435-1.pdf; Author: CERN DEM MR; CreateDate: 05.07.2016; LatestRevisionDate: 05.07.2016
R12 = R0805_1K_1%_0.125W_100PPM: as R14 on sheet Main; Part Number: R0805_1K_1%_0.125W_100PPM; Component Kind: Standard; Component Type: Standard; Pin Count: 2; Value: 1k; Status: Preferred; Tolerance: ±1%; Manufacturer Part Number: R0805_1K_1%_0.125W_100PPM; Case: 0805; Mounted: Yes; Sense: No; Socket: No; SMD: Yes; Manufacturer1 Example: NIC COMPONENT; Manufacturer1 ComponentHeight: 0.6mm; HelpURL: \\cern.ch\dfs\Applications\Altium\Datasheets\R0805_NIC_NRC.pdf; Author: CERN DEM JLC; CreateDate: 03.12.2007; LatestRevisionDate: 13.03.2008